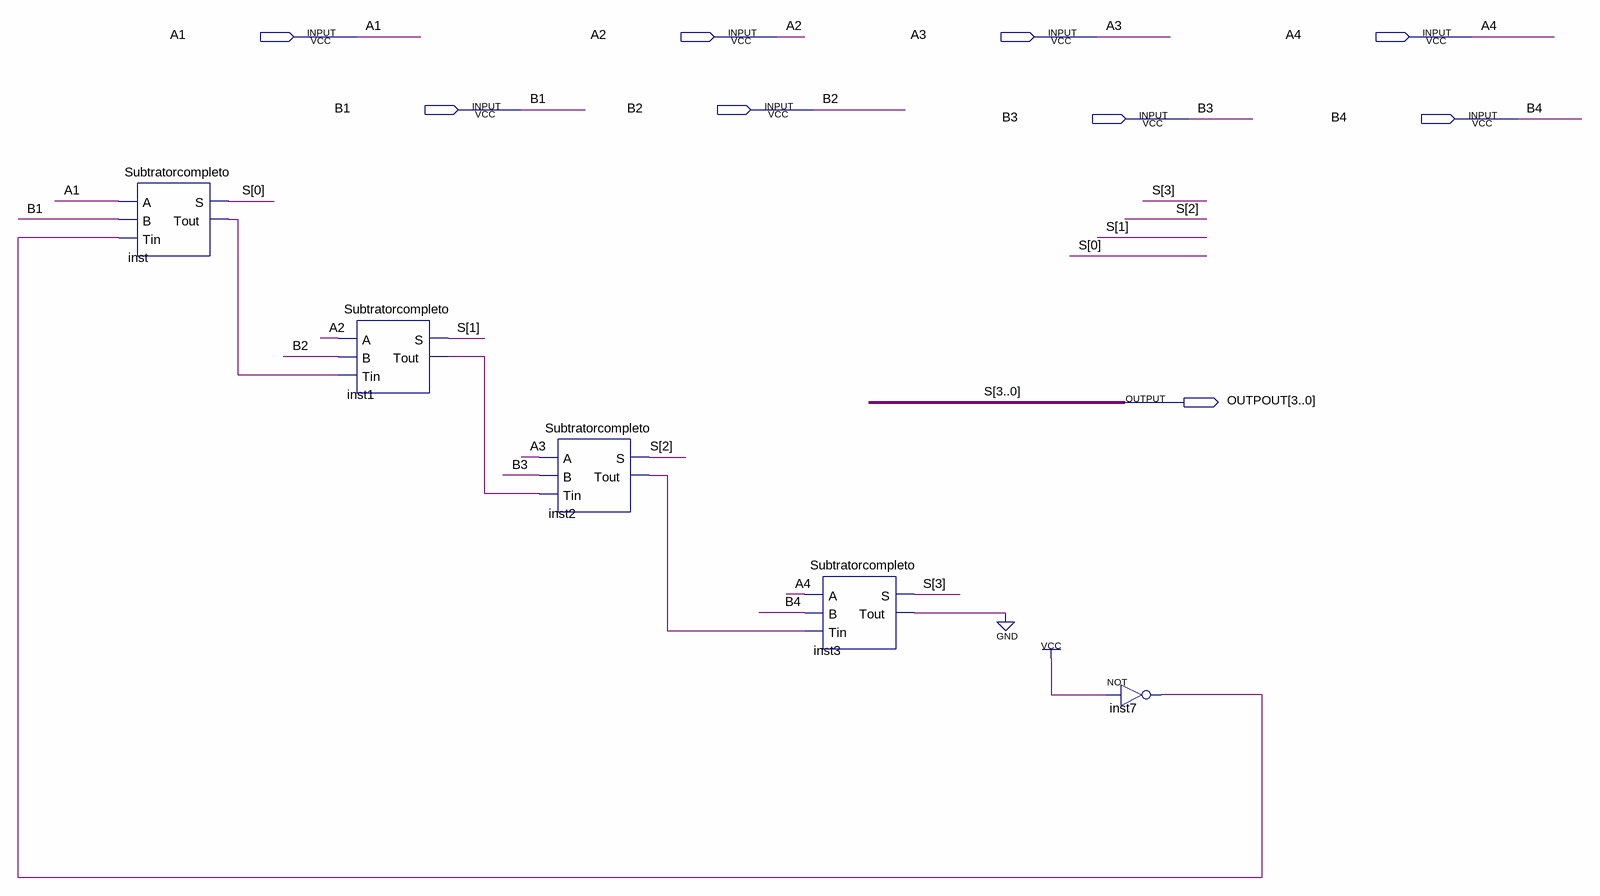
[diagram p0: schematic sheet]
// Quartus schematic Subtratorcompleto4bits.bdf as structural Verilog: 5 symbols, 9 pins
module Subtratorcompleto4bits (
  input  A1,
  input  A2,
  input  A3,
  input  A4,
  input  B1,
  input  B2,
  input  B3,
  input  B4,
  output [3:0] OUTPOUT
);

  wire inst1_tout, inst2_tout, inst3_tout, inst7_out, inst_tout;

  Subtratorcompleto inst (.A(A1), .B(B1), .Tin(inst7_out), .S(OUTPOUT[0]), .Tout(inst_tout));
  Subtratorcompleto inst1 (.A(A2), .B(B2), .Tin(inst_tout), .S(OUTPOUT[1]), .Tout(inst1_tout));
  Subtratorcompleto inst2 (.A(A3), .B(B3), .Tin(inst1_tout), .S(OUTPOUT[2]), .Tout(inst2_tout));
  Subtratorcompleto inst3 (.A(A4), .B(B4), .Tin(inst2_tout), .S(OUTPOUT[3]), .Tout(inst3_tout));
  not inst7 (inst7_out, 1'b1);
  // also tied to GND on the sheet: inst3_tout

  // Other names for the same wires on the sheet: S[3:0] = OUTPOUT
endmodule
